# Altium schematic sheet TP_IHM_CONNECTOR.SchDoc
size A4
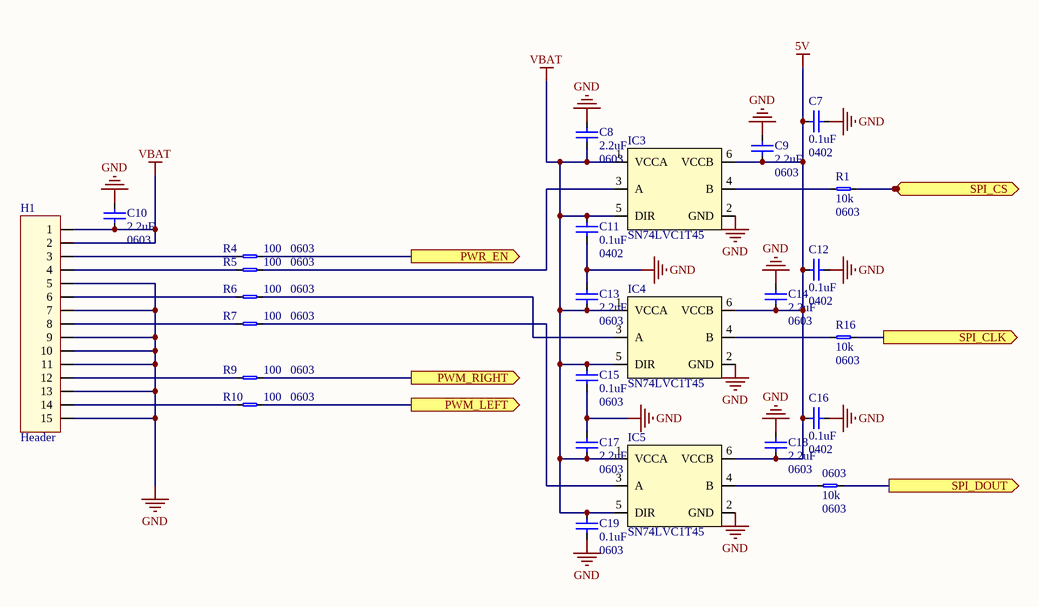
[diagram p0: TP_IHM_CONNECTOR.SchDoc]

## Parts
0603  value 10k  Package: 0603  [0603_RES_LD]  (hidden comment: Resistor)
C7  value 0.1uF  Package: 0402  [0603_CAP_LD]  (hidden comment: CerCap)
C8  value 2.2uF  Package: 0603  [0603_CAP_LD]  (hidden comment: CerCap)
C9  value 2.2uF  Package: 0603  [0603_CAP_LD]  (hidden comment: CerCap)
C10  value 2.2uF  Package: 0603  [0603_CAP_LD]  (hidden comment: CerCap)
C11  value 0.1uF  Package: 0402  [0603_CAP_LD]  (hidden comment: CerCap)
C12  value 0.1uF  Package: 0402  [0603_CAP_LD]  (hidden comment: CerCap)
C13  value 2.2uF  Package: 0603  [0603_CAP_LD]  (hidden comment: CerCap)
C14  value 2.2uF  Package: 0603  [0603_CAP_LD]  (hidden comment: CerCap)
C15  value 0.1uF  Package: 0603  [0603_CAP_LD]  (hidden comment: CerCap)
C16  value 0.1uF  Package: 0402  [0603_CAP_LD]  (hidden comment: CerCap)
C17  value 2.2uF  Package: 0603  [0603_CAP_LD]  (hidden comment: CerCap)
C18  value 2.2uF  Package: 0603  [0603_CAP_LD]  (hidden comment: CerCap)
C19  value 0.1uF  Package: 0603  [0603_CAP_LD]  (hidden comment: CerCap)
H1  Header  [653115131822]
IC3  SN74LVC1T45  [MO-203AB_LD]
IC4  SN74LVC1T45  [MO-203AB_LD]
IC5  SN74LVC1T45  [MO-203AB_LD]
R1  value 10k  Package: 0603  [0603_RES_LD]  (hidden comment: Resistor)
R4  value 100  Package: 0603  [0603_RES_LD]  (hidden comment: Resistor)
R5  value 100  Package: 0603  [0603_RES_LD]  (hidden comment: Resistor)
R6  value 100  Package: 0603  [0603_RES_LD]  (hidden comment: Resistor)
R7  value 100  Package: 0603  [0603_RES_LD]  (hidden comment: Resistor)
R9  value 100  Package: 0603  [0603_RES_LD]  (hidden comment: Resistor)
R10  value 100  Package: 0603  [0603_RES_LD]  (hidden comment: Resistor)
R16  value 10k  Package: 0603  [0603_RES_LD]  (hidden comment: Resistor)

## Ports
PWM_LEFT (out), PWM_RIGHT (out), PWR_EN (out), SPI_CLK (out), SPI_CS (out), SPI_DOUT (out)

## Nets
5V: C7.2 C9.1 C12.2 C14.1 C16.2 C18.1 IC3.6(VCCB) IC4.6(VCCB) IC5.6(VCCB)
GND: C7.1 C8.2 C9.2 C10.2 C11.1 C12.1 C13.2 C14.2 C15.1 C16.1 C17.2 C18.2 C19.1 H1.5 H1.7 H1.9 H1.10 H1.11 H1.13 H1.15 IC3.2(GND) IC4.2(GND) IC5.2(GND)
VBAT: C8.1 C10.1 C11.2 C13.1 C15.2 C17.1 C19.2 H1.1 H1.2 IC3.1(VCCA) IC3.5(DIR) IC4.1(VCCA) IC4.5(DIR) IC5.1(VCCA) IC5.5(DIR)
PWM_LEFT: R10.2 ; port PWM_LEFT
PWM_RIGHT: R9.2 ; port PWM_RIGHT
PWR_EN: R4.2 ; port PWR_EN
SPI_CLK: R16.2 ; port SPI_CLK
SPI_CS: R1.2 ; port SPI_CS
SPI_DOUT: 0603.2 ; port SPI_DOUT
Net0603_1: 0603.1 IC5.4(B)
NetH1_3: H1.3 R4.1
NetH1_4: H1.4 R5.1
NetH1_6: H1.6 R6.1
NetH1_8: H1.8 R7.1
NetH1_12: H1.12 R9.1
NetH1_14: H1.14 R10.1
NetIC3_3: IC3.3(A) R5.2
NetIC3_4: IC3.4(B) R1.1
NetIC4_3: IC4.3(A) R6.2
NetIC4_4: IC4.4(B) R16.1
NetIC5_3: IC5.3(A) R7.2

## Library data of the parts
C7-C19 = CerCap: Ceramic Capacitor; Type: *; Voltage/Power: *
H1 = HEADER_15x1: Header 15x1
IC3-IC5 = SN74LVC1T45: Single Bit Dual Supply Buffer
0603 R1 R4-R7 R9 R10 R16 = Resistor: Precision: *